# EAGLE design BreakoutBoardAFE4404-THROUGH (EAGLE 8.4.2)
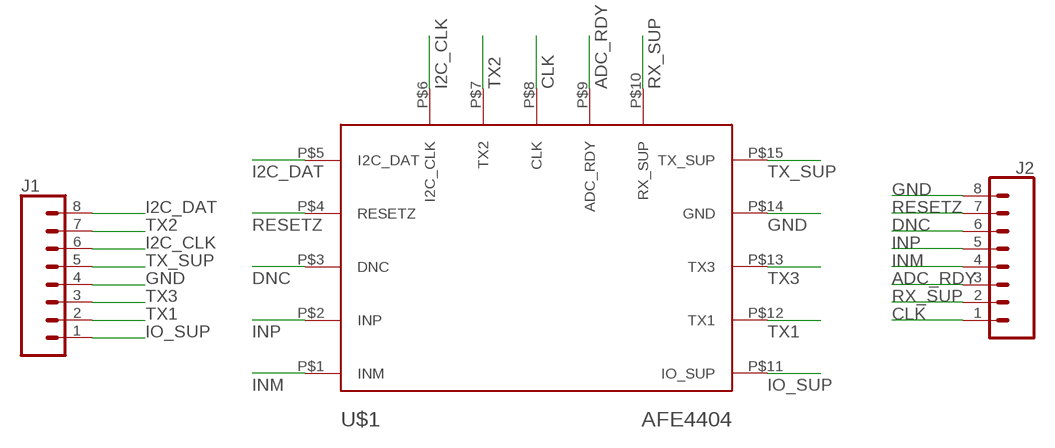
[diagram p0: schematic, sheet 1]

## Parts
J1  CONN_08"  [1X08]
J2  CONN_08"  [1X08]
U$1  AFE4404  [AFE4404-THROUGH]

## Nets
ADC_RDY: J2.3 U$1.P$9(ADC_RDY)
CLK: J2.1 U$1.P$8(CLK)
DNC: J2.6 U$1.P$3(DNC)
GND: J1.4 J2.8 U$1.P$14(GND)
I2C_CLK: J1.6 U$1.P$6(I2C_CLK)
I2C_DAT: J1.8 U$1.P$5(I2C_DAT)
INM: J2.4 U$1.P$1(INM)
INP: J2.5 U$1.P$2(INP)
IO_SUP: J1.1 U$1.P$11(IO_SUP)
RESETZ: J2.7 U$1.P$4(RESETZ)
RX_SUP: J2.2 U$1.P$10(RX_SUP)
TX1: J1.2 U$1.P$12(TX1)
TX2: J1.7 U$1.P$7(TX2)
TX3: J1.3 U$1.P$13(TX3)
TX_SUP: J1.5 U$1.P$15(TX_SUP)

## Library data of the parts
J1 J2 = SparkFun-Connectors:CONN_08: Multi connection point. Often used as Generic Header-pin footprint for 0.1 inch spaced/style header connections On any of the 0.1 inch spaced packages, you can populate with these: Break Away Headers - Straight <https://www.sparkfun.com/products/116> (PRT-00116) Break Away Male Headers - Right Angle <https://www.sparkfun.com/products/553> (PRT-00553) Female Headers <https://www.sparkfun.com/products/115> (PRT-00115) Break Away Headers - Machine Pin <https://www.sparkfun.com/products/117> (PRT-00117) Break Away Female Headers - Swiss Machine Pin <https://www.sparkfun.com/products/743> (PRT-00743) Arduino Stackable Header - 8 Pin <https://www.sparkfun.com/products/9279> (PRT-09279) For SCREWTERMINALS and SPRING TERMINALS visit here: Screw Terimnals on SparkFun.com <https://www.sparkfun.com/search/results?term=Screw+Terminals> (5mm/3.5mm/2.54mm spacing) This device is also useful as a general connection point to wire up your design to another part of your project. Our various solder wires solder well into these plated through hole pads. Hook-Up Wire - Assortment (Stranded, 22 AWG) <https://www.sparkfun.com/products/11375> (PRT-11375) Hook-Up Wire - Assortment (Solid Core, 22 AWG) <https://www.sparkfun.com/products/11367> (PRT-11367) View the entire wire category on our website here <https://www.sparkfun.com/categories/141> Special notes: Molex polarized connector foot print use with SKU : PRT-08231 with associated crimp pins and housings. 1MM SMD Version SKU: PRT-10208 NOTES ON THE VARIANTS LOCK and LOCK_LONGPADS... This footprint was designed to help hold the alignment of a through-hole component (i.e. 6-pin header) while soldering it into place. You may notice that each hole has been shifted either up or down by 0.005 of an inch from it's more standard position (which is a perfectly straight line). This slight alteration caused the pins (the squares in the middle) to touch the edges of the holes. Because they are alternating, it causes a "brace" to hold the component in place. 0.005 has proven to be the perfect amount of "off-center" position when using our standard breakaway headers. Although looks a little odd when you look at the bare footprint, once you have a header in there, the alteration is very hard to notice. Also,if you push a header all the way into place, it is covered up entirely on the bottom side.; PROD_ID: CONN-08438
U$1 = CustomLibrary:AFE4404

## Board
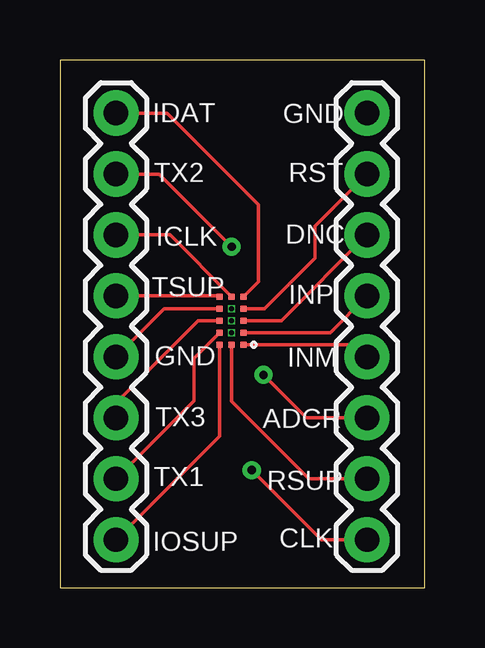
[diagram p1: board, top side]
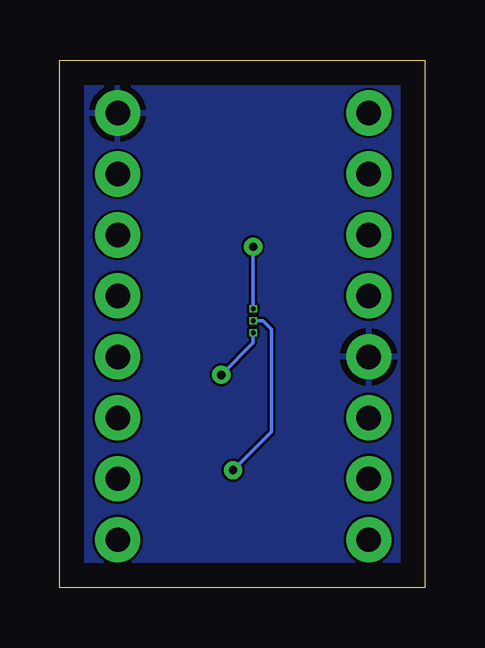
[diagram p2: board, bottom side, seen from below]

Size 15.22 x 21.98 mm. Coordinates in mm from the lower left corner, seen from the top.
Outline: 0,0 15.22,0 15.22,21.98 0,21.98 0,0
Copper layers (1*16): Top 0.035mm / dielectric 1.5mm / Bottom 0.035mm
Design rules "default *": minimum track width 0.05mm, minimum drill 0.1mm, track to track 0.1mm, track to pad 0.1mm, pad to pad 0.15mm, via to via 6mil, smd to smd 6mil, copper to edge 40mil, drill to drill 6mil, minimum pad ring 0.05mm, minimum via ring 8mil, stop-mask expansion 1mil, vias tented up to drill 0mil, thermal gap 10mil

### Footprints (pad centres in the part's own frame; a part is rotated, then mirrored left to right if it is on the bottom)
1X08 = drill 1.016 pad 1.88: 1 0,0; 2 2.54,0; 3 5.08,0; 4 7.62,0; 5 10.16,0; 6 12.7,0; 7 15.24,0; 8 17.78,0
AFE4404-THROUGH = smd 0.25 x 0.25: P$1 1,0; P$2 1,0.5; P$3 1,1; P$4 1,1.5; P$5 1,2; P$6 0.5,2; P$10 0.5,0; P$11 0,0; P$12 0,0.5; P$13 0,1; P$14 0,1.5; P$15 0,2 | drill 0.2 pad 0.254 square: P$7 0.5,1.5; P$8 0.5,1; P$9 0.5,0.5

### Placement (x,y rotation side)
J1  2.34,1.99 90 top
J2  12.81,1.99 90 top
U$1  6.66,10.12 0 top

### Tracks (layer width: path | path; a pad name or v marks a point on that pad's centre or on a via)
ADC_RDY  (via drill 0.35)
  Top 0.152: J2.3 10.28,7.07 v8.49,8.86
  Bottom 0.152: U$1.P$9 7.16,10.19 v8.49,8.86
CLK  (via drill 0.35)
  Top 0.152: J2.1 10.9,1.99 v8,4.89
  Bottom 0.152: 6.79,6.1 6.66,6.23 | 6.79,6.1 v8,4.89 | U$1.P$8 6.76,11.12 6.4,10.76 6.4,6.49 6.79,6.1
DNC
  Top 0.152: U$1.P$3 9.24,11.12 J2.6
GND
  Top 0.152: J1.4 4.35,11.62 U$1.P$14
  pour Bottom: 0.17,21.68 14.66,21.68 14.86,0.51 14.73,0.38 0.37,0.38
I2C_CLK
  Top 0.152: J1.6 4.59,14.69 U$1.P$6
I2C_DAT
  Top 0.152: U$1.P$5 8.28,12.74 8.28,15.95 4.46,19.77 J1.8
INM
  Top 0.152: U$1.P$1 12.3,10.12 J2.4
INP
  Top 0.152: U$1.P$2 11.28,10.62 J2.5
IO_SUP
  Top 0.152: J1.1 6.66,6.31 U$1.P$11
RESETZ
  Top 0.152: U$1.P$4 8.53,11.62 10.64,13.73 10.64,15.06 J2.7
RX_SUP
  Top 0.152: J2.2 10.39,4.53 7.16,7.76 U$1.P$10
TX1
  Top 0.152: U$1.P$12 5.6,9.56 5.6,7.79 J1.2
TX2  (via drill 0.35)
  Top 0.152: J1.7 4.13,17.23 v7.16,14.2
  Bottom 0.152: U$1.P$7 v7.16,14.2
TX3
  Top 0.152: J1.3 2.34,7.7 5.76,11.12 U$1.P$13
TX_SUP
  Top 0.152: J1.5 6.63,12.15 U$1.P$15

### Text on the board
tNames: IDAT | GND | TX2 | RST | ICLK | DNC | TSUP | INP | GND | INM | TX3 | ADCR | TX1 | RSUP | IOSUP | CLK